# EAGLE design untitled_zaliv (EAGLE 5.07)
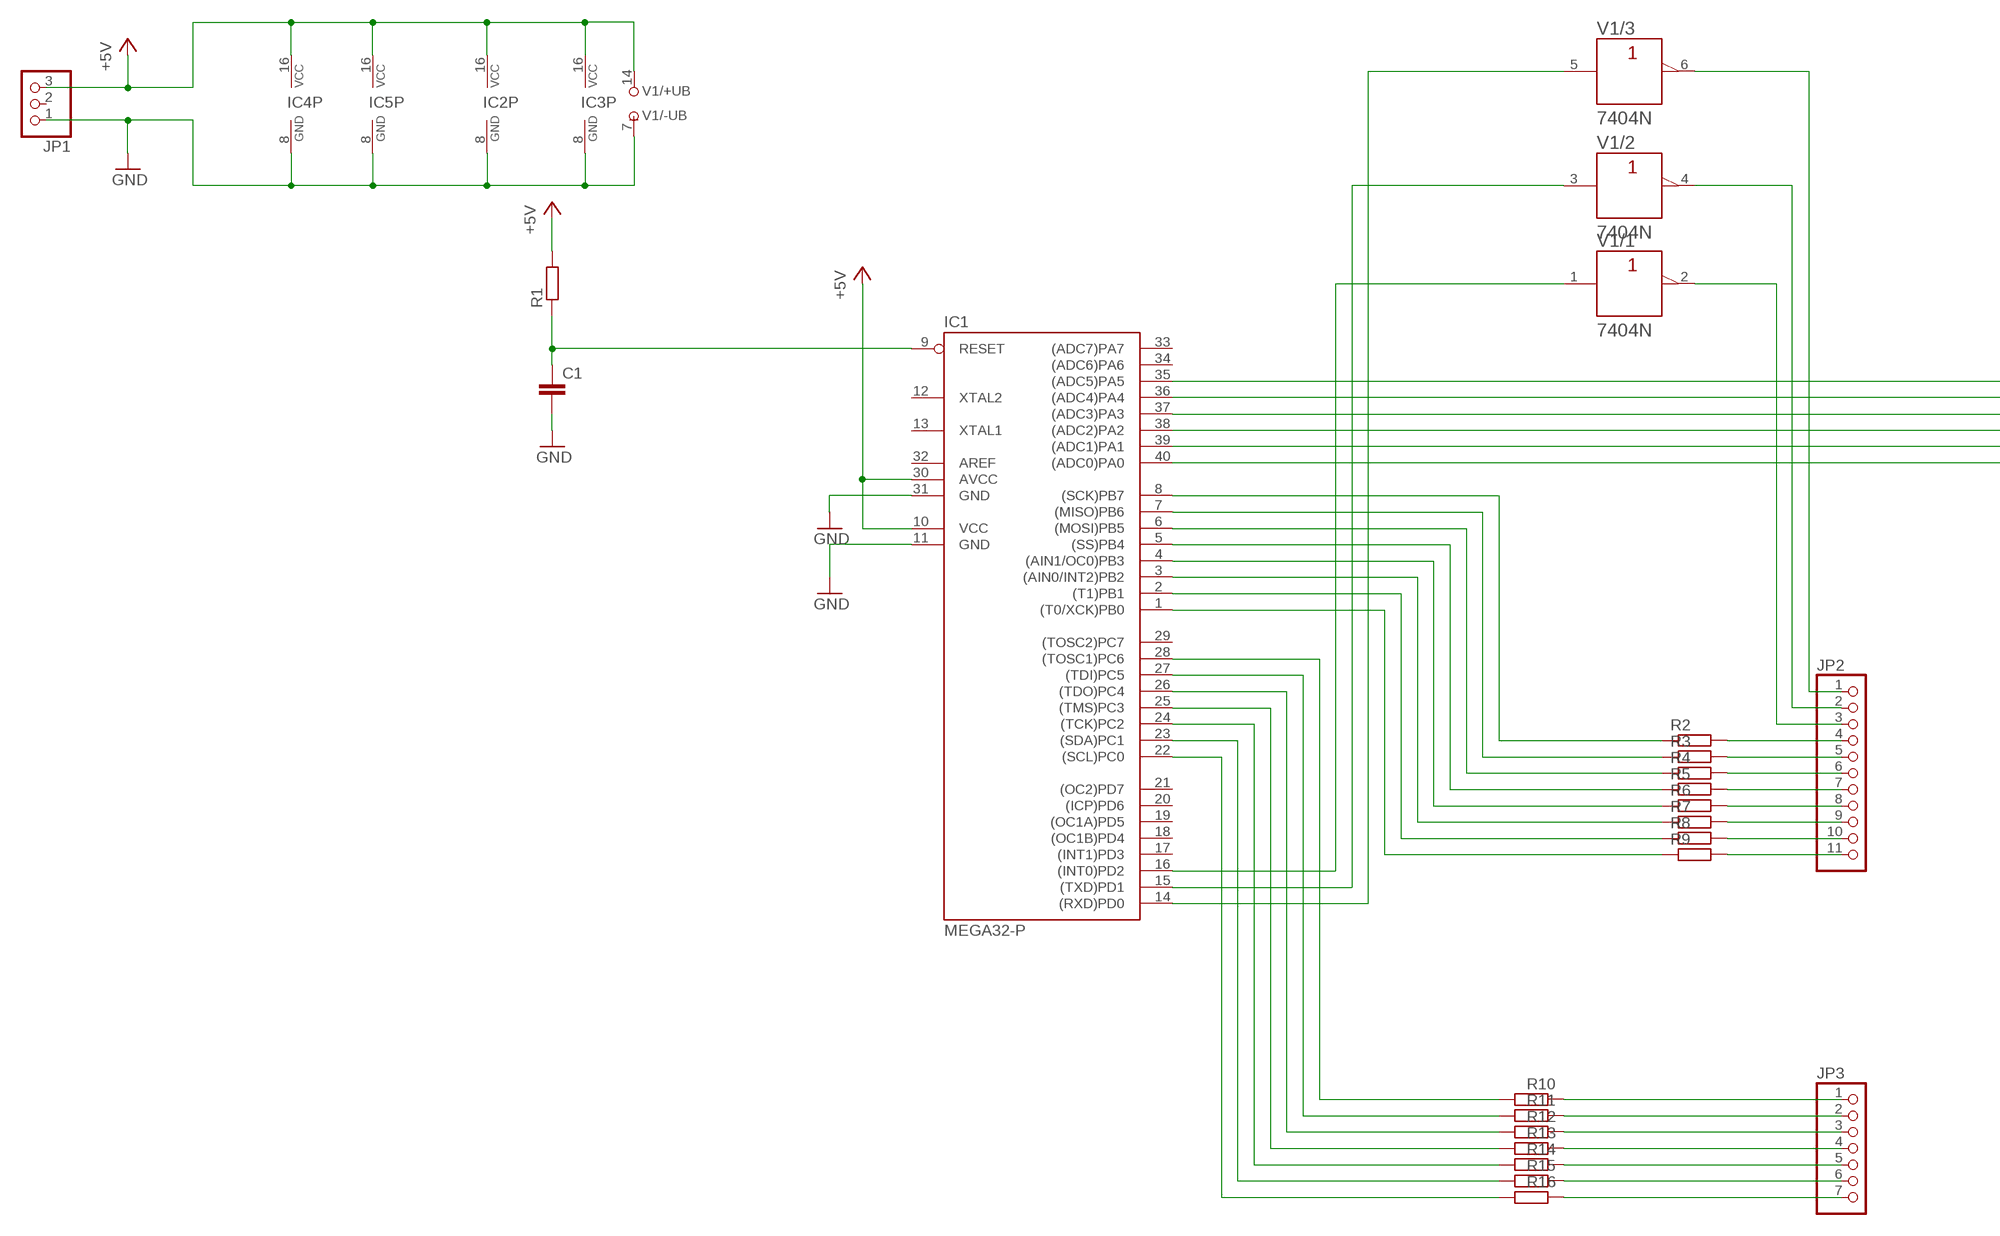
[diagram p0: schematic, sheet 1, part 1 of 2]
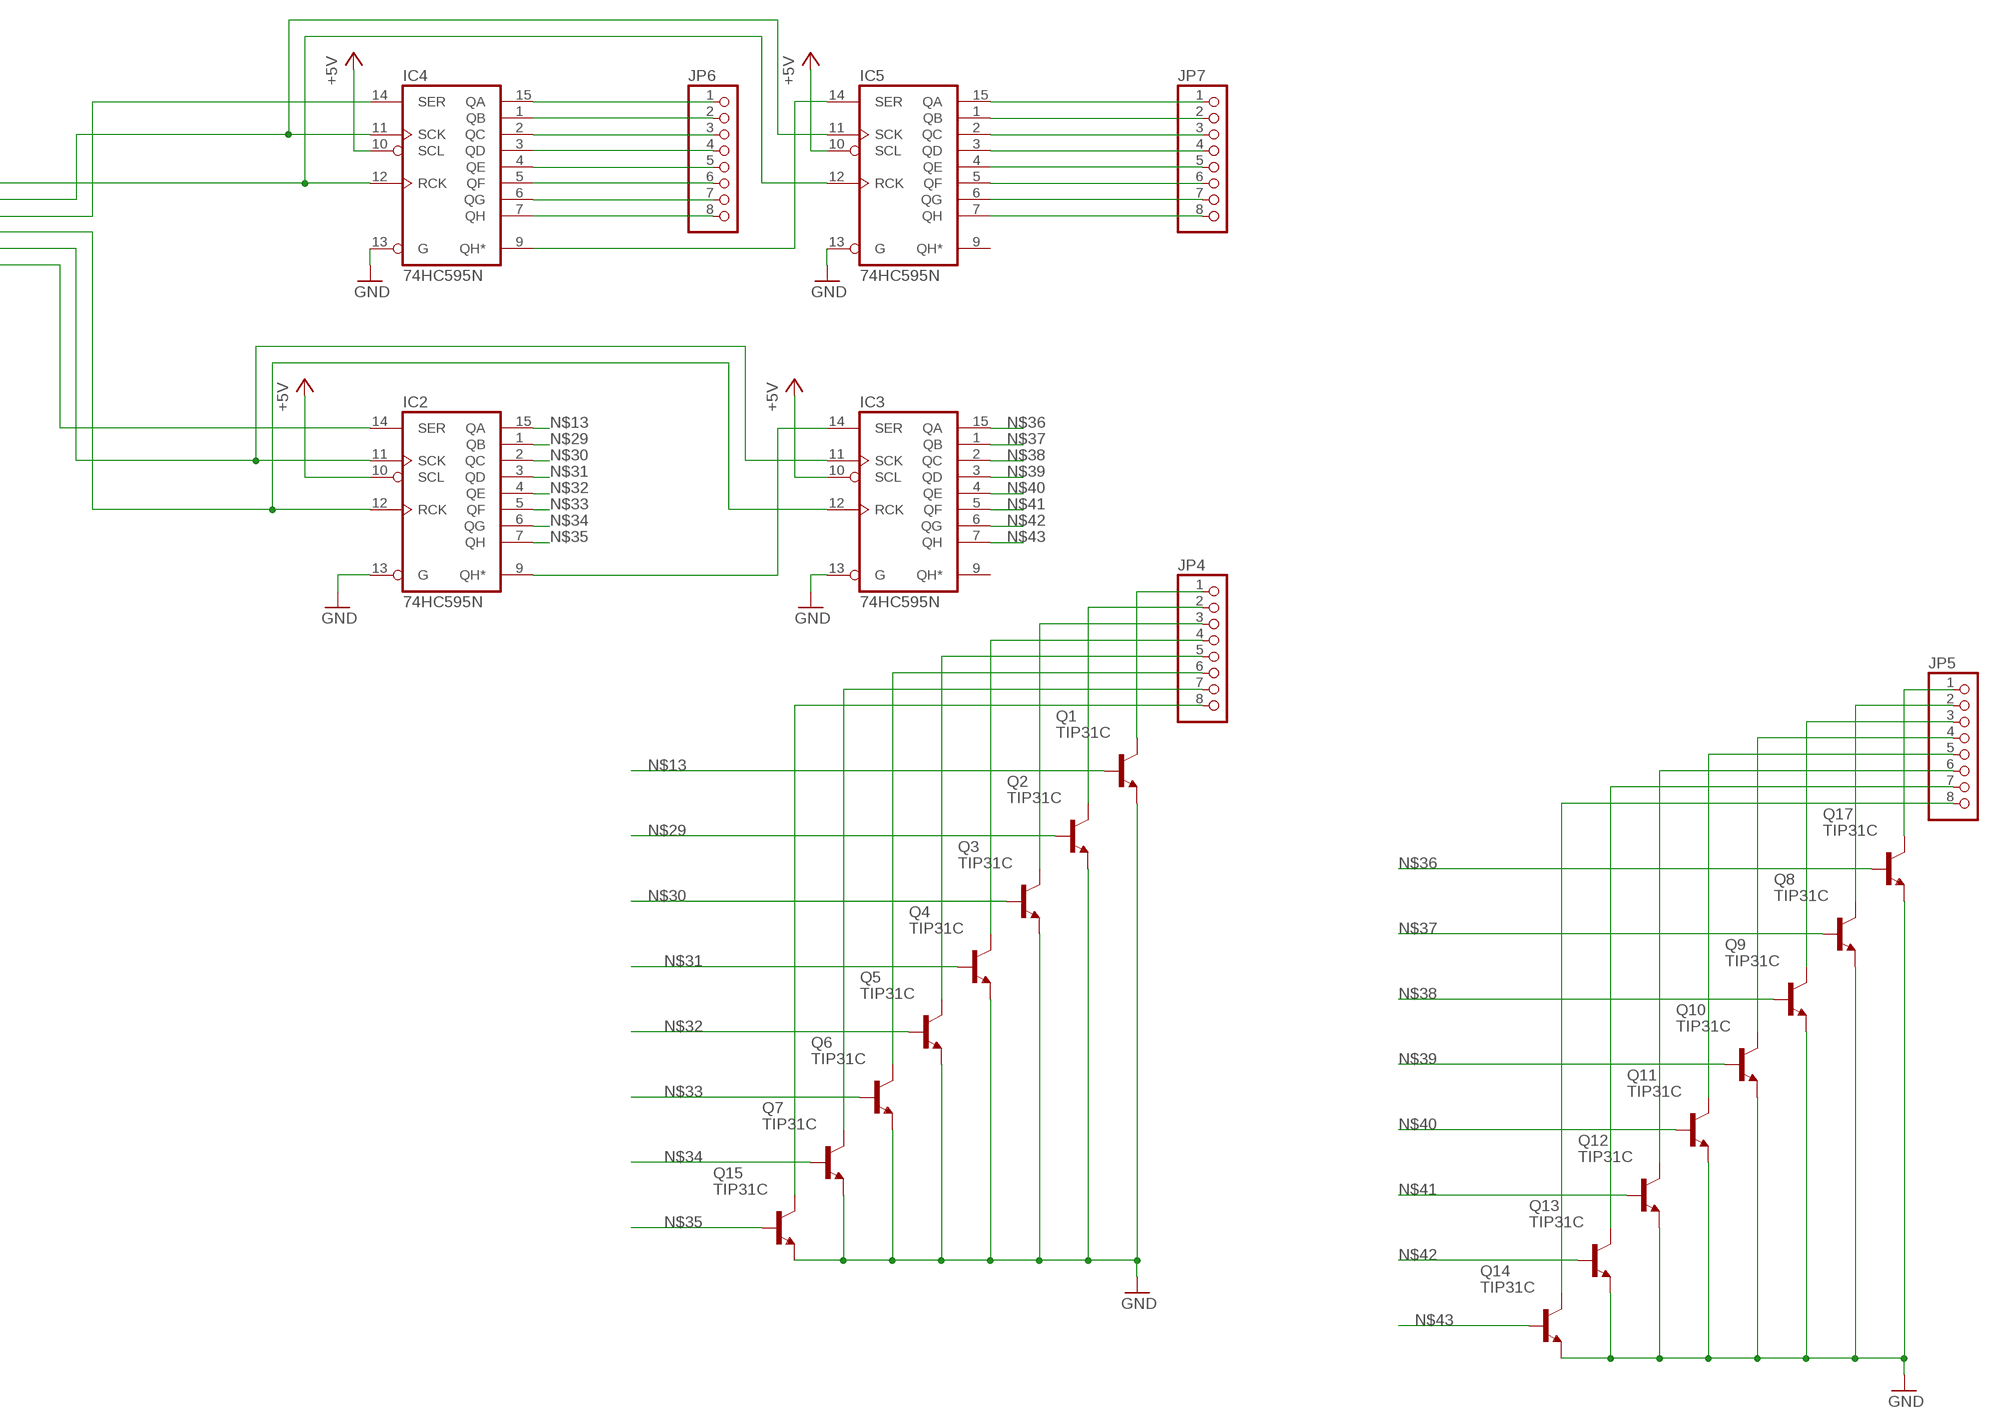
[diagram p1: schematic, sheet 1, part 2 of 2]

## Parts
C1  C-EU050-024X044  [C050-024X044]
IC1  MEGA32-P  [DIL40]
IC2  74HC595N  [DIL16]
IC3  74HC595N  [DIL16]
IC4  74HC595N  [DIL16]
IC5  74HC595N  [DIL16]
JP1  PINHD-1X3/90  [1X03/90]
JP2  PINHD-1X11/90  [1X11/90]
JP3  PINHD-1X7/90  [1X07/90]
JP4  PINHD-1X8/90  [1X08/90]
JP5  PINHD-1X8/90  [1X08/90]
JP6  PINHD-1X8/90  [1X08/90]
JP7  PINHD-1X8/90  [1X08/90]
Q1  TIP31C  [TO220]
Q2  TIP31C  [TO220]
Q3  TIP31C  [TO220]
Q4  TIP31C  [TO220]
Q5  TIP31C  [TO220]
Q6  TIP31C  [TO220]
Q7  TIP31C  [TO220]
Q8  TIP31C  [TO220]
Q9  TIP31C  [TO220]
Q10  TIP31C  [TO220]
Q11  TIP31C  [TO220]
Q12  TIP31C  [TO220]
Q13  TIP31C  [TO220]
Q14  TIP31C  [TO220]
Q15  TIP31C  [TO220]
Q17  TIP31C  [TO220]
R1  R-EU_0204/7  [0204/7]
R2  R-EU_0207/12  [0207/12]
R3  R-EU_0207/12  [0207/12]
R4  R-EU_0207/12  [0207/12]
R5  R-EU_0207/12  [0207/12]
R6  R-EU_0207/12  [0207/12]
R7  R-EU_0207/12  [0207/12]
R8  R-EU_0207/12  [0207/12]
R9  R-EU_0207/12  [0207/12]
R10  R-EU_0207/12  [0207/12]
R11  R-EU_0207/12  [0207/12]
R12  R-EU_0207/12  [0207/12]
R13  R-EU_0207/12  [0207/12]
R14  R-EU_0207/12  [0207/12]
R15  R-EU_0207/12  [0207/12]
R16  R-EU_0207/12  [0207/12]
V1  7404N  [DIL14]

## Nets
+5V: IC1.10(VCC) IC1.30(AVCC) IC2.10(SCL) IC2.16(VCC) IC3.10(SCL) IC3.16(VCC) IC4.10(SCL) IC4.16(VCC) IC5.10(SCL) IC5.16(VCC) JP1.3 R1.2 V1.14(/+UB:+UB)
GND: C1.2 IC1.11(GND) IC1.31(GND) IC2.8(GND) IC2.13(G) IC3.8(GND) IC3.13(G) IC4.8(GND) IC4.13(G) IC5.8(GND) IC5.13(G) JP1.1 Q1.3(E) Q2.3(E) Q3.3(E) Q4.3(E) Q5.3(E) Q6.3(E) Q7.3(E) Q8.3(E) Q9.3(E) Q10.3(E) Q11.3(E) Q12.3(E) Q13.3(E) Q14.3(E) Q15.3(E) Q17.3(E) V1.7(/-UB:-UB)
N$1: IC2.9(QH*) IC3.14(SER)
N$2: IC1.40((ADC0)PA0) IC2.14(SER)
N$3: IC1.39((ADC1)PA1) IC2.11(SCK) IC3.11(SCK)
N$4: IC1.38((ADC2)PA2) IC2.12(RCK) IC3.12(RCK)
N$5: IC1.37((ADC3)PA3) IC4.14(SER)
N$6: IC1.36((ADC4)PA4) IC4.11(SCK) IC5.11(SCK)
N$7: IC1.35((ADC5)PA5) IC4.12(RCK) IC5.12(RCK)
N$8: IC4.9(QH*) IC5.14(SER)
N$9: C1.1 IC1.9(RESET) R1.1
N$10: IC1.14((RXD)PD0) V1.5(/3:A)
N$11: IC1.15((TXD)PD1) V1.3(/2:A)
N$12: IC1.16((INT0)PD2) V1.1(/1:A)
N$13: IC2.15(QA) Q1.1(B)
N$14: IC1.8((SCK)PB7) R2.1
N$15: IC1.7((MISO)PB6) R3.1
N$16: IC1.6((MOSI)PB5) R4.1
N$17: IC1.5((SS)PB4) R5.1
N$18: IC1.4((AIN1/OC0)PB3) R6.1
N$19: IC1.3((AIN0/INT2)PB2) R7.1
N$20: IC1.2((T1)PB1) R8.1
N$21: IC1.1((T0/XCK)PB0) R9.1
N$22: IC1.22((SCL)PC0) R16.2
N$23: IC1.23((SDA)PC1) R15.2
N$24: IC1.24((TCK)PC2) R14.2
N$25: IC1.25((TMS)PC3) R13.2
N$26: IC1.26((TDO)PC4) R12.2
N$27: IC1.27((TDI)PC5) R11.2
N$28: IC1.28((TOSC1)PC6) R10.2
N$29: IC2.1(QB) Q2.1(B)
N$30: IC2.2(QC) Q3.1(B)
N$31: IC2.3(QD) Q4.1(B)
N$32: IC2.4(QE) Q5.1(B)
N$33: IC2.5(QF) Q6.1(B)
N$34: IC2.6(QG) Q7.1(B)
N$35: IC2.7(QH) Q15.1(B)
N$36: IC3.15(QA) Q17.1(B)
N$37: IC3.1(QB) Q8.1(B)
N$38: IC3.2(QC) Q9.1(B)
N$39: IC3.3(QD) Q10.1(B)
N$40: IC3.4(QE) Q11.1(B)
N$41: IC3.5(QF) Q12.1(B)
N$42: IC3.6(QG) Q13.1(B)
N$43: IC3.7(QH) Q14.1(B)
N$44: JP4.1 Q1.2(C)
N$45: JP4.2 Q2.2(C)
N$46: JP4.3 Q3.2(C)
N$47: JP4.4 Q4.2(C)
N$48: JP4.5 Q5.2(C)
N$49: JP4.6 Q6.2(C)
N$50: JP4.7 Q7.2(C)
N$51: JP4.8 Q15.2(C)
N$53: JP5.1 Q17.2(C)
N$54: JP5.2 Q8.2(C)
N$55: JP5.3 Q9.2(C)
N$56: JP5.4 Q10.2(C)
N$57: JP5.5 Q11.2(C)
N$58: JP5.6 Q12.2(C)
N$59: JP5.7 Q13.2(C)
N$60: IC4.15(QA) JP6.1
N$61: IC4.1(QB) JP6.2
N$62: IC4.2(QC) JP6.3
N$63: IC4.3(QD) JP6.4
N$64: IC4.4(QE) JP6.5
N$65: IC4.5(QF) JP6.6
N$66: IC4.6(QG) JP6.7
N$67: IC4.7(QH) JP6.8
N$68: IC5.15(QA) JP7.1
N$69: IC5.1(QB) JP7.2
N$70: IC5.2(QC) JP7.3
N$71: IC5.3(QD) JP7.4
N$72: IC5.4(QE) JP7.5
N$73: IC5.5(QF) JP7.6
N$74: IC5.6(QG) JP7.7
N$75: IC5.7(QH) JP7.8
N$76: JP2.4 R2.2
N$77: JP2.5 R3.2
N$78: JP2.6 R4.2
N$79: JP2.7 R5.2
N$80: JP2.8 R6.2
N$81: JP2.9 R7.2
N$82: JP2.10 R8.2
N$83: JP2.11 R9.2
N$84: JP5.8 Q14.2(C)
N$88: JP3.1 R10.1
N$89: JP3.2 R11.1
N$90: JP3.3 R12.1
N$91: JP3.4 R13.1
N$92: JP3.5 R14.1
N$93: JP3.6 R15.1
N$94: JP3.7 R16.1
N$95: JP2.1 V1.6(/3:Y)
N$101: JP2.2 V1.4(/2:Y)
N$102: JP2.3 V1.2(/1:Y)
Unconnected: IC1.12(XTAL2) IC1.13(XTAL1) IC1.17((INT1)PD3) IC1.18((OC1B)PD4) IC1.19((OC1A)PD5) IC1.20((ICP)PD6) IC1.21((OC2)PD7) IC1.29((TOSC2)PC7) IC1.32(AREF) IC1.33((ADC7)PA7) IC1.34((ADC6)PA6) IC3.9(QH*) IC5.9(QH*) JP1.2 V1.8(/4:Y) V1.9(/4:A) V1.10(/5:Y) V1.11(/5:A) V1.12(/6:Y) V1.13(/6:A)

## Library data of the parts
C1 = rcl:C-EU: CAPACITOR, European symbol
IC1 = atmel:MEGA32-P: MICROCONTROLLER 32 Kbytes FLASH 2 Kbytes SRAM 1 Kbytes EEPROM USART 8-channel 10 bit ADC Source: www.atmel.com .. doc2503.pdf
IC2-IC5 = 74xx-eu:74*595: 8-bit SHIFT REGISTER, output latch
JP1 = pinhead:PINHD-1X3: PIN HEADER
JP2 = pinhead:PINHD-1X11: PIN HEADER
JP3 = pinhead:PINHD-1X7: PIN HEADER
JP4-JP7 = pinhead:PINHD-1X8: PIN HEADER
Q1-Q15 Q17 = transistor-npn:TIP31C*: NPN Transistor
R1-R16 = rcl:R-EU_: RESISTOR, European symbol
V1 = 74ttl-din:74*04: Hex INVERTER

## Board
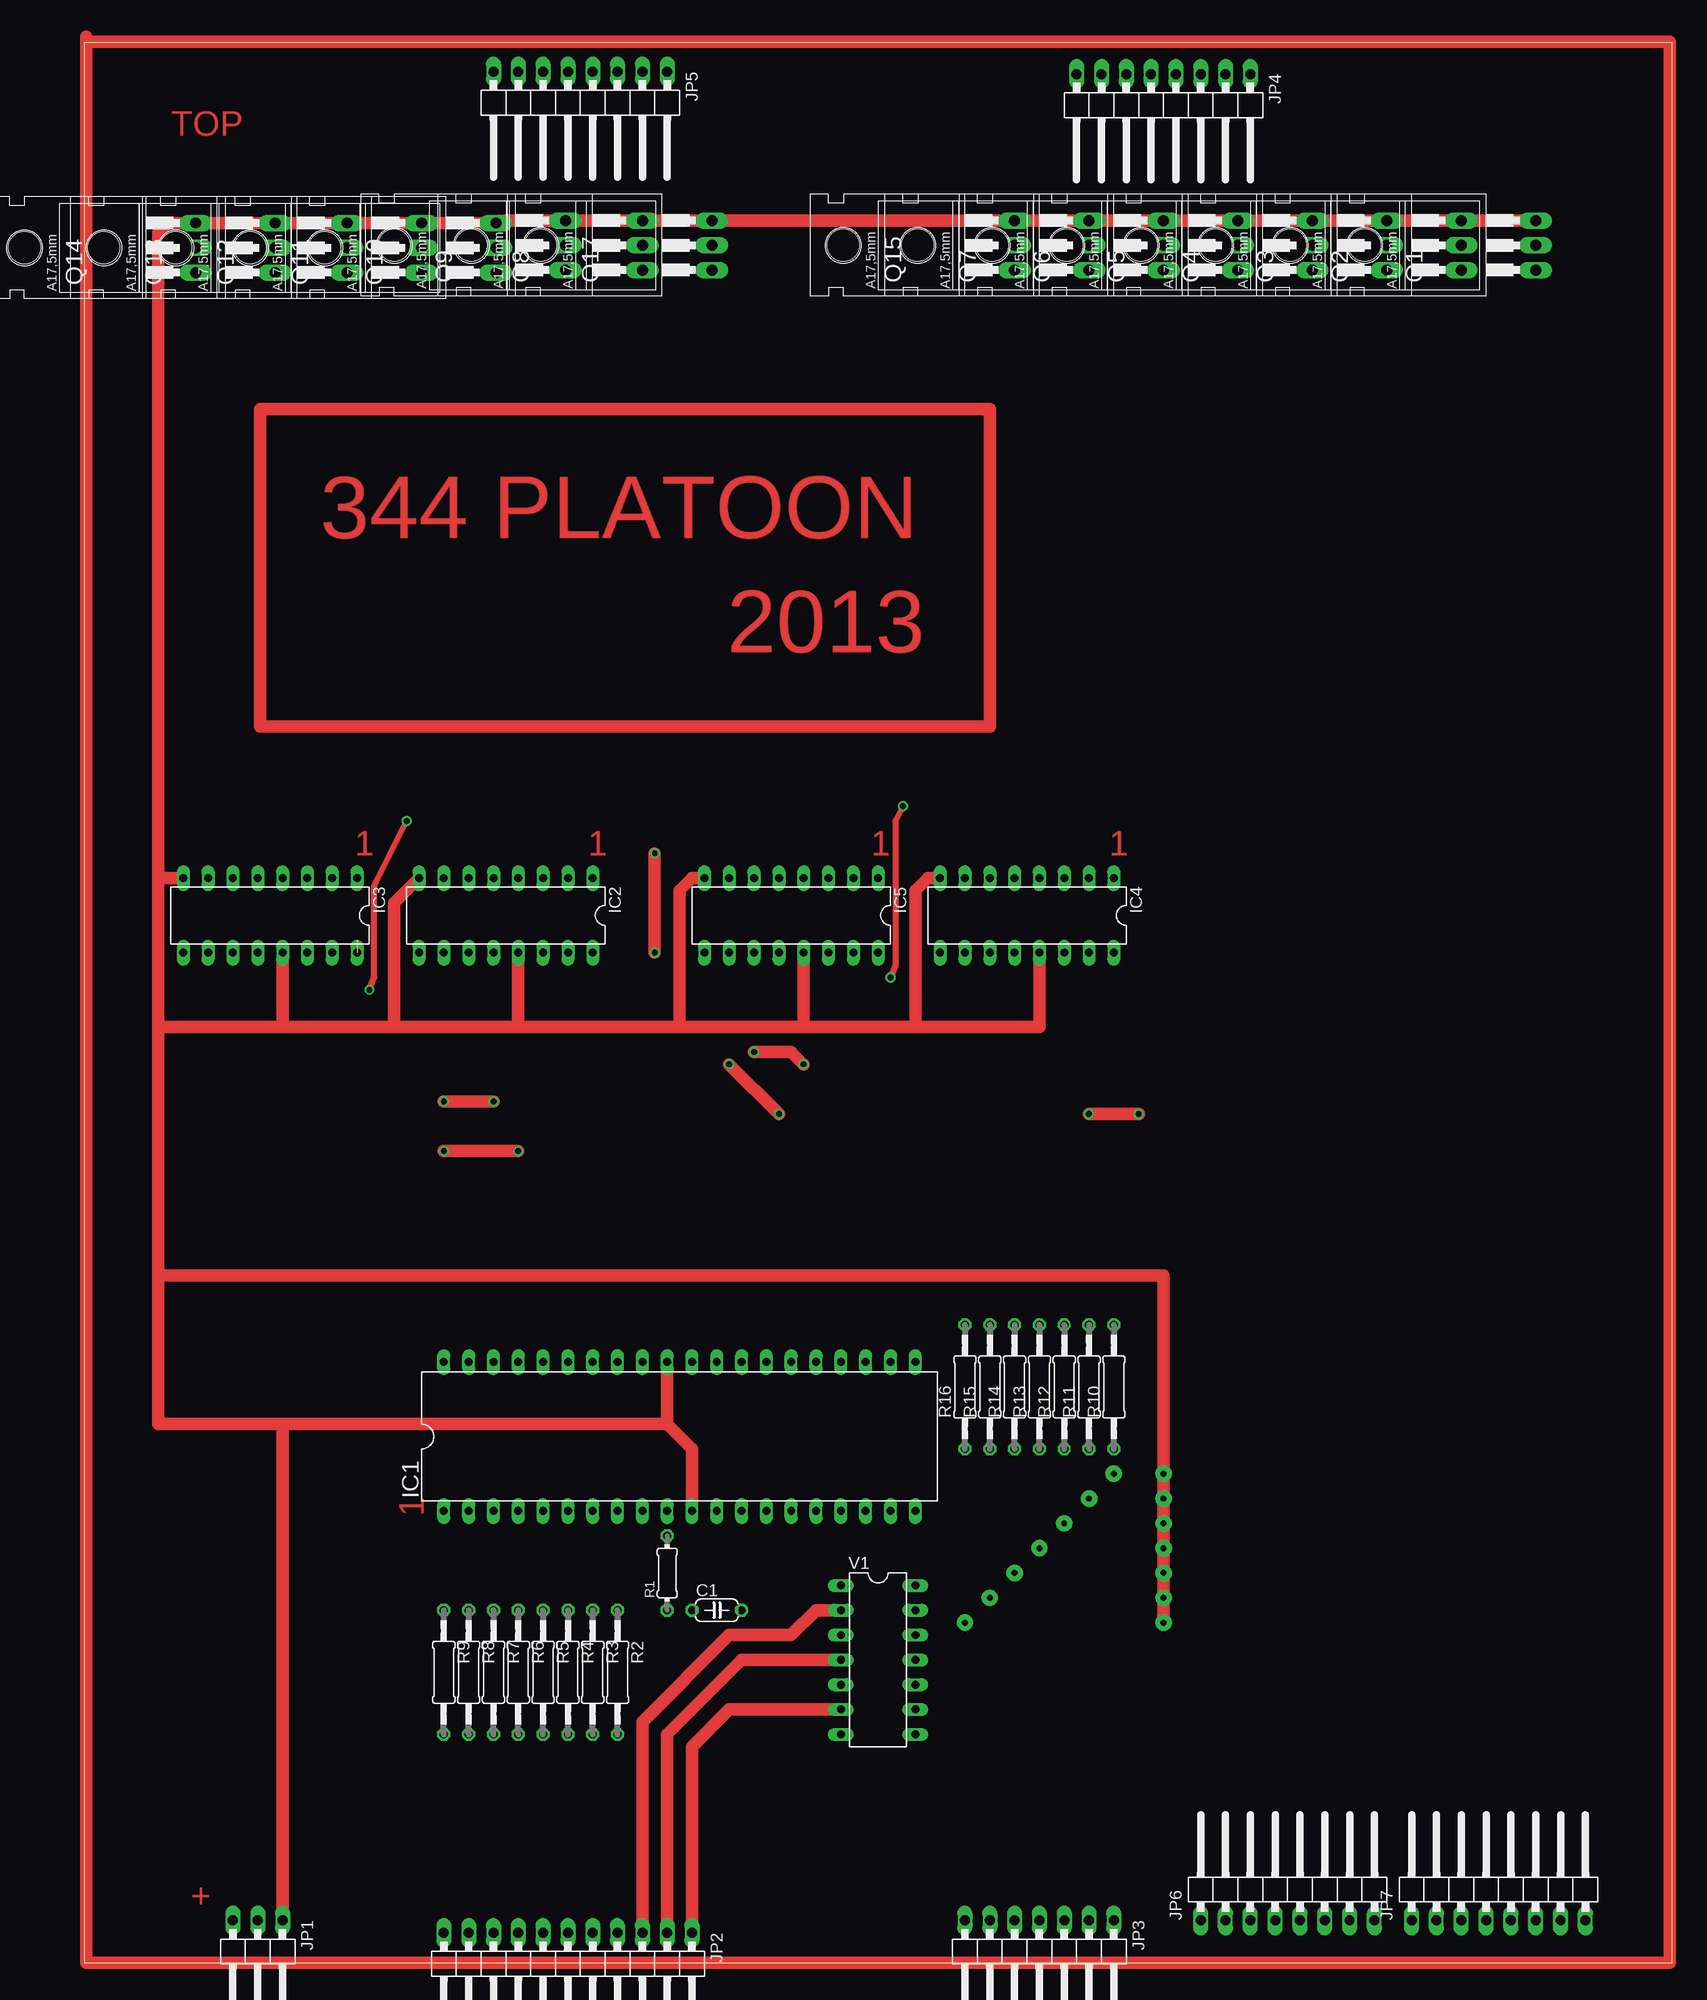
[diagram p2: board, top side]
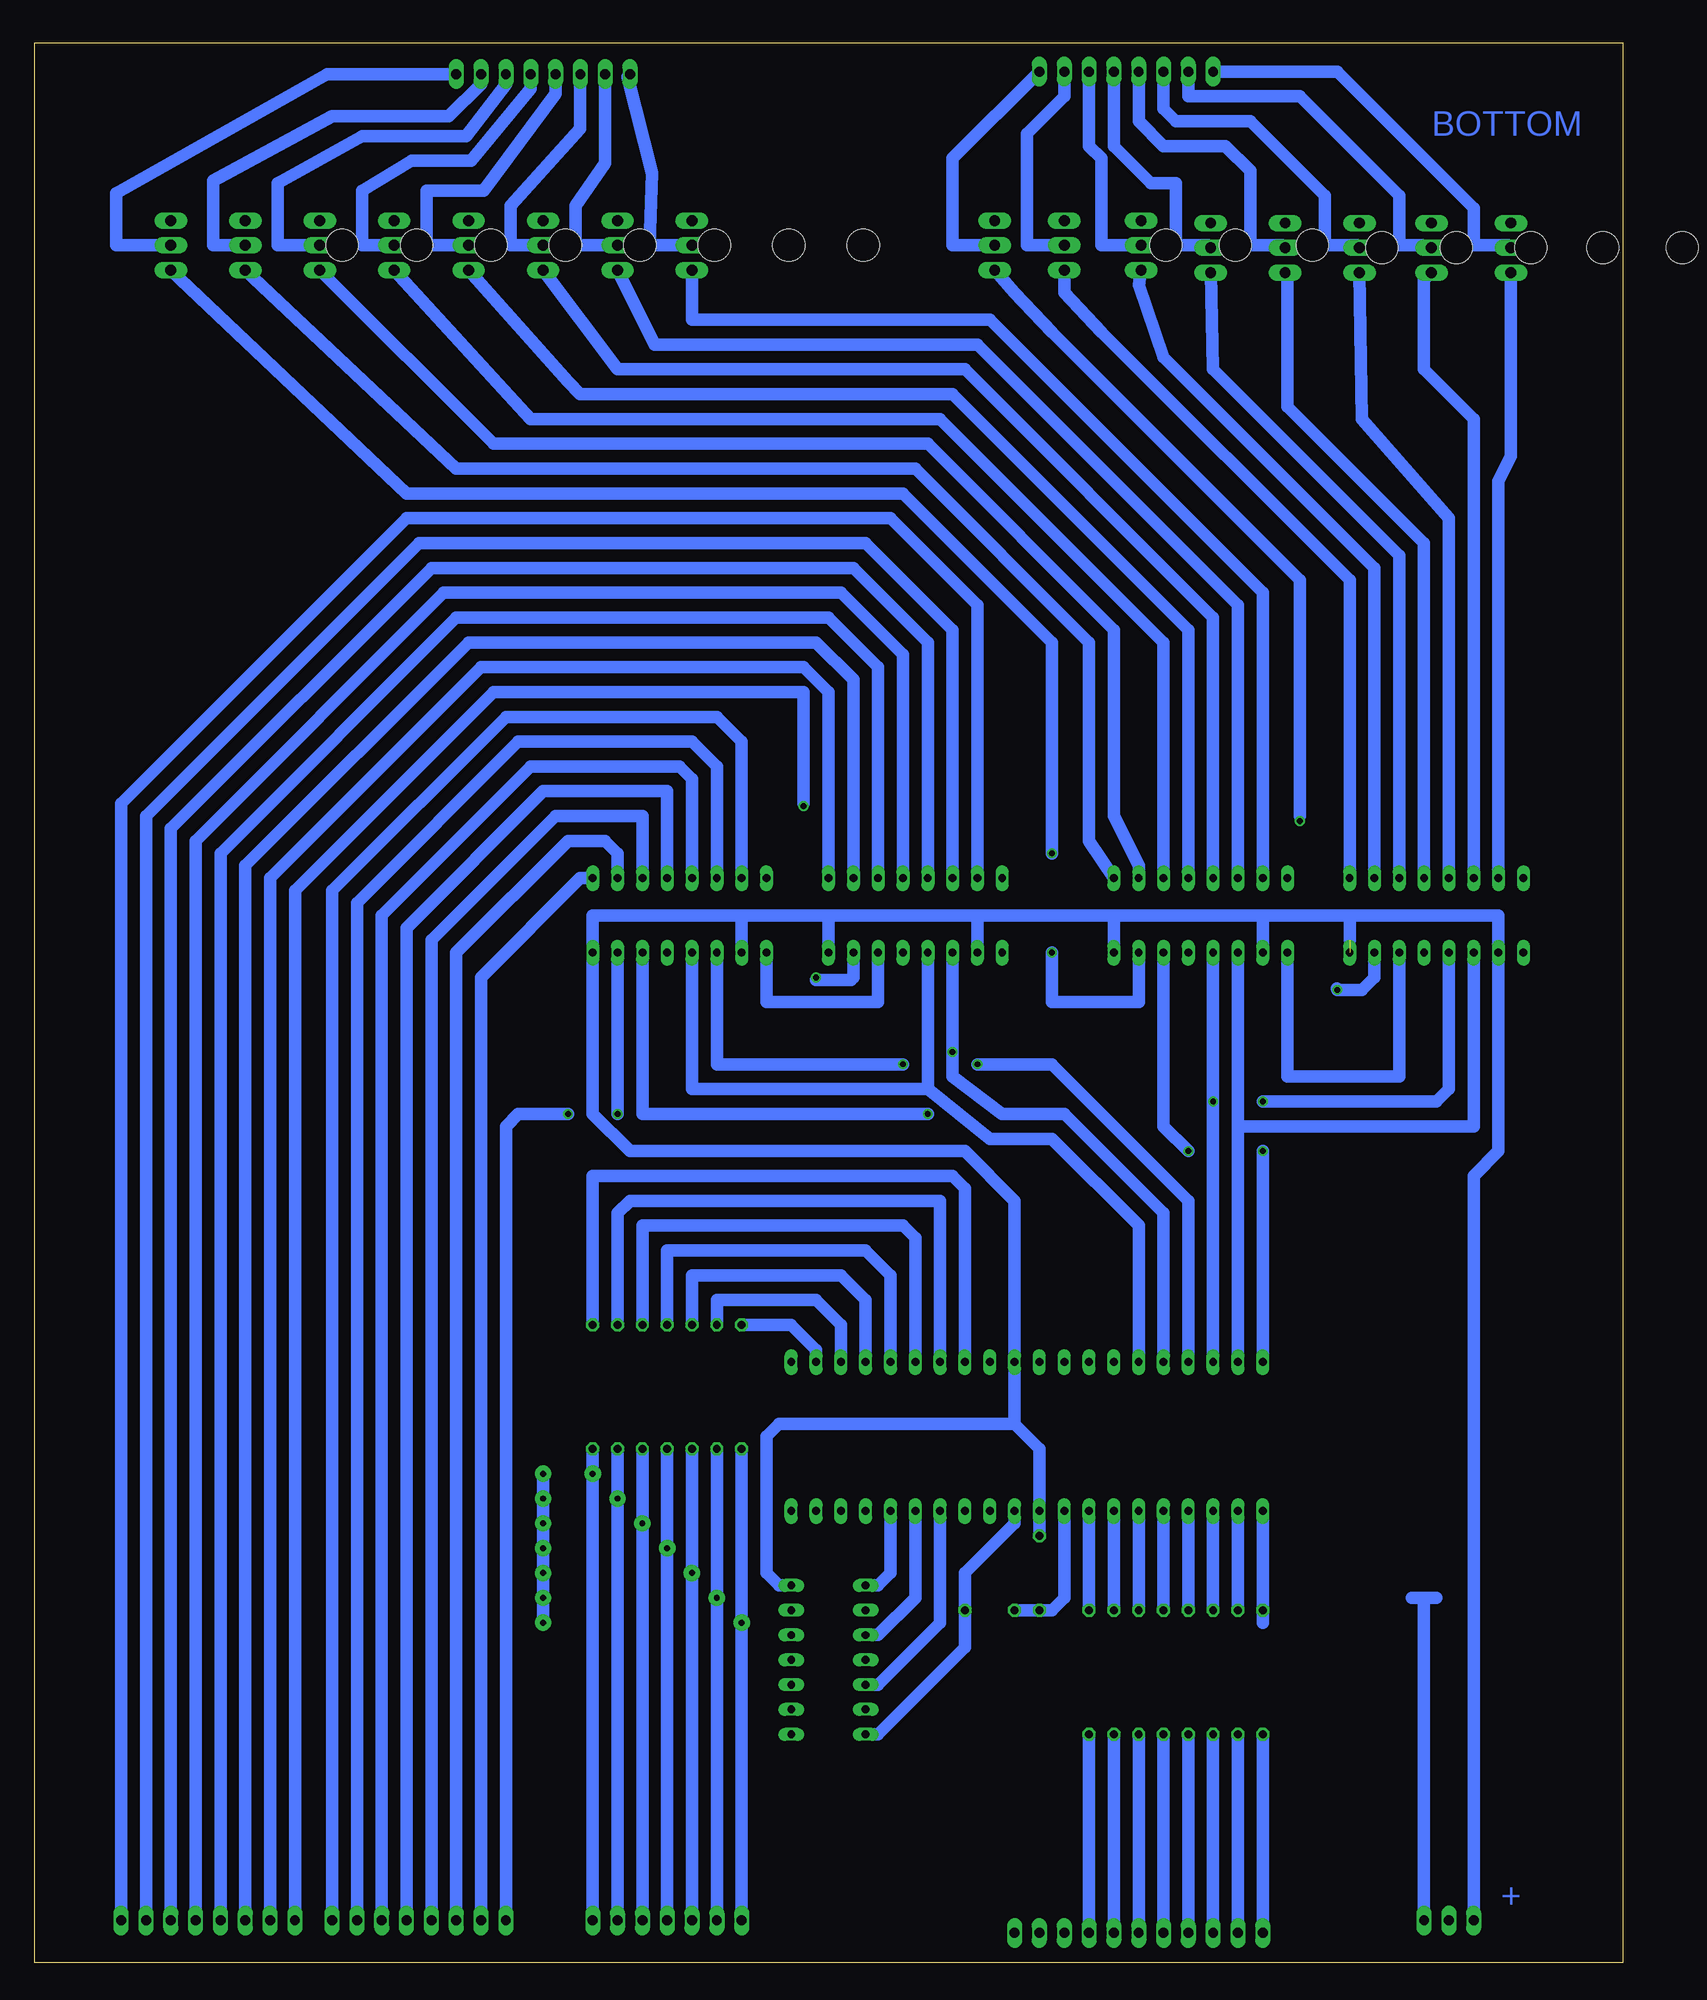
[diagram p3: board, bottom side, seen from below]

Size 162.54 x 196.52 mm. Coordinates in mm from the lower left corner, seen from the top.
Outline: 0,0 162.54,0 162.54,196.52 0,196.52 0,0
Copper layers (1*16): Top 0.035mm / dielectric 1.5mm / Bottom 0.035mm
Design rules "default *": minimum track width 10mil, minimum drill 24mil, track to track 8mil, track to pad 8mil, pad to pad 8mil, via to via 8mil, smd to smd 8mil, copper to edge 40mil, drill to drill 8mil, minimum pad ring 10mil, minimum via ring 8mil, stop-mask expansion 4mil, vias tented up to drill 0mil, thermal gap 10mil

### Footprints (pad centres in the part's own frame; a part is rotated, then mirrored left to right if it is on the bottom)
C050-024X044 = drill 0.813 octagon: 1 -2.54,0; 2 2.54,0
DIL40 = drill 0.813 long: 1 -24.13,-7.62; 2 -21.59,-7.62; 3 -19.05,-7.62; 4 -16.51,-7.62; 5 -13.97,-7.62; 6 -11.43,-7.62; 7 -8.89,-7.62; 8 -6.35,-7.62; 9 -3.81,-7.62; 10 -1.27,-7.62; 11 1.27,-7.62; 12 3.81,-7.62; 13 6.35,-7.62; 14 8.89,-7.62; 15 11.43,-7.62; 16 13.97,-7.62; 17 16.51,-7.62; 18 19.05,-7.62; 19 21.59,-7.62; 20 24.13,-7.62; 21 24.13,7.62; 22 21.59,7.62; 23 19.05,7.62; 24 16.51,7.62; 25 13.97,7.62; 26 11.43,7.62; 27 8.89,7.62; 28 6.35,7.62; 29 3.81,7.62; 30 1.27,7.62; 31 -1.27,7.62; 32 -3.81,7.62; 33 -6.35,7.62; 34 -8.89,7.62; 35 -11.43,7.62; 36 -13.97,7.62; 37 -16.51,7.62; 38 -19.05,7.62; 39 -21.59,7.62; 40 -24.13,7.62
DIL16 = drill 0.813 long: 1 -8.89,-3.81; 2 -6.35,-3.81; 3 -3.81,-3.81; 4 -1.27,-3.81; 5 1.27,-3.81; 6 3.81,-3.81; 7 6.35,-3.81; 8 8.89,-3.81; 9 8.89,3.81; 10 6.35,3.81; 11 3.81,3.81; 12 1.27,3.81; 13 -1.27,3.81; 14 -3.81,3.81; 15 -6.35,3.81; 16 -8.89,3.81
1X03/90 = drill 1.016 long: 1 -2.54,-3.81; 2 0,-3.81; 3 2.54,-3.81
1X11/90 = drill 1.016 long: 1 -12.7,-3.81; 2 -10.16,-3.81; 3 -7.62,-3.81; 4 -5.08,-3.81; 5 -2.54,-3.81; 6 0,-3.81; 7 2.54,-3.81; 8 5.08,-3.81; 9 7.62,-3.81; 10 10.16,-3.81; 11 12.7,-3.81
1X07/90 = drill 1.016 long: 1 -7.62,-3.81; 2 -5.08,-3.81; 3 -2.54,-3.81; 4 0,-3.81; 5 2.54,-3.81; 6 5.08,-3.81; 7 7.62,-3.81
1X08/90 = drill 1.016 long: 1 -8.89,-3.81; 2 -6.35,-3.81; 3 -3.81,-3.81; 4 -1.27,-3.81; 5 1.27,-3.81; 6 3.81,-3.81; 7 6.35,-3.81; 8 8.89,-3.81
TO220 = drill 1.118 long: 1 -2.54,-6.35; 2 0,-6.35; 3 2.54,-6.35 | hole 3.302: 0,11.176
0204/7 = drill 0.813 octagon: 1 -3.81,0; 2 3.81,0
0207/12 = drill 0.813 octagon: 1 -6.35,0; 2 6.35,0
DIL14 = drill 0.813 long: 1 -7.62,-3.81; 2 -5.08,-3.81; 3 -2.54,-3.81; 4 0,-3.81; 5 2.54,-3.81; 6 5.08,-3.81; 7 7.62,-3.81; 8 7.62,3.81; 9 5.08,3.81; 10 2.54,3.81; 11 0,3.81; 12 -2.54,3.81; 13 -5.08,3.81; 14 -7.62,3.81

### Placement (x,y rotation side)
C1  64.77,36.07 0 top
IC1  60.96,53.85 0 top
IC2  43.18,107.19 180 top
IC3  19.05,107.19 180 top
IC4  96.52,107.19 180 top
IC5  72.39,107.19 180 top
JP1  17.78,0.51 180 top
JP2  49.53,-0.76 180 top
JP3  97.79,0.51 180 top
JP4  110.49,189.48 180 top
JP5  50.8,189.74 180 top
JP6  123.19,8.13 0 top
JP7  144.78,8.13 0 top
Q1  142.24,175.77 90 top
Q2  134.62,175.77 90 top
Q3  127,175.77 90 top
Q4  119.38,175.77 90 top
Q5  111.76,175.77 90 top
Q6  104.14,175.77 90 top
Q7  96.52,175.77 90 top
Q8  50.8,175.77 90 top
Q9  42.93,175.77 90 top
Q10  35.81,175.51 90 top
Q11  28.19,175.51 90 top
Q12  20.57,175.51 90 top
Q13  13.21,175.51 90 top
Q14  5.08,175.51 90 top
Q15  88.9,175.77 90 top
Q17  57.91,175.77 90 top
R1  59.69,39.88 90 top
R2  54.61,29.72 270 top
R3  52.07,29.72 270 top
R4  49.53,29.72 270 top
R5  46.99,29.72 270 top
R6  44.45,29.72 270 top
R7  41.91,29.72 270 top
R8  39.37,29.72 270 top
R9  36.83,29.72 270 top
R10  105.41,58.93 90 top
R11  102.87,58.93 90 top
R12  100.33,58.93 90 top
R13  97.79,58.93 90 top
R14  95.25,58.93 90 top
R15  92.71,58.93 90 top
R16  90.17,58.93 90 top
V1  81.28,30.99 270 top

### Tracks (layer width: path | path; a pad name or v marks a point on that pad's centre or on a via)
+5V  (1 unrouted)
  Bottom 1.27: R1.2 IC1.10 59.69,52.58 62.23,55.12 | 62.23,55.12 IC1.30 62.23,77.98 67.31,83.06 101.6,83.06 105.41,86.87 IC4.16 105.41,107.19 90.17,107.19 | JP1.3 15.24,80.52 12.7,83.06 IC3.10 12.7,107.19 27.94,107.19 | 36.83,107.19 IC2.10 | 27.94,107.19 36.83,107.19 | 27.94,107.19 27.94,104.65 | 36.83,107.19 52.07,107.19 | 52.07,107.19 IC2.16 | 52.07,107.19 66.04,107.19 | 90.17,107.19 IC4.10 | 81.28,107.19 IC5.16 | 81.28,107.19 90.17,107.19 | 66.04,107.19 IC5.10 | 66.04,107.19 81.28,107.19 | V1.14 86.36,38.61 87.63,39.88 87.63,53.85 86.36,55.12 62.23,55.12
GND  (via drill 0.6 pad 1.68)
  Top 1.27: 59.69,55.12 IC1.31 | 59.69,55.12 62.23,52.58 IC1.11 | Q1.3 Q2.3 Q3.3 Q4.3 Q5.3 Q6.3 Q7.3 Q15.3 Q17.3 Q8.3 Q9.3 42.42,178.31 Q10.3 Q11.3 Q12.3 Q13.3 Q14.3 8.64,178.05 7.62,177.04 7.62,111 | 7.62,111 IC3.8 | 7.62,111 7.62,95.76 | 7.62,95.76 7.62,70.36 | 7.62,70.36 7.62,55.12 20.32,55.12 | 20.32,55.12 59.69,55.12 | 20.32,55.12 JP1.1 | IC4.8 86.36,111 85.09,109.73 85.09,95.76 | 85.09,95.76 97.79,95.76 IC4.13 | 73.66,95.76 85.09,95.76 | 73.66,95.76 IC5.13 | IC5.8 62.23,111 60.96,109.73 60.96,95.76 | 60.96,95.76 73.66,95.76 | 44.45,95.76 60.96,95.76 | 44.45,95.76 IC2.13 | IC2.8 31.75,108.46 31.75,95.76 | 31.75,95.76 44.45,95.76 | 20.32,95.76 31.75,95.76 | 20.32,95.76 IC3.13 | 7.62,95.76 20.32,95.76 | v110.49,34.8 v110.49,50.04 110.49,70.36 7.62,70.36
  Bottom 1.27: IC1.11 62.23,44.96 67.31,39.88 C1.2 67.31,32.26 76.2,23.37 V1.7 | JP1.1 20.32,37.34 | v110.49,50.04 v110.49,34.8
N$1
  Bottom 1.27: IC3.14 22.86,90.68 34.29,90.68 IC2.9
N$2  (via drill 0.6)
  Top 1.27: v36.83,83.06 v44.45,83.06
  Bottom 1.27: IC2.14 46.99,85.6 v44.45,83.06 | IC1.40 v36.83,83.06
N$3
  Bottom 1.27: IC1.39 39.37,85.6 | 39.37,85.6 IC2.11 | IC3.11 15.24,85.6 39.37,85.6
N$4  (via drill 0.6)
  Top 1.27: v41.91,88.14 v36.83,88.14
  Bottom 1.27: IC1.38 v41.91,88.14 IC2.12 | IC3.12 17.78,89.41 19.05,88.14 v36.83,88.14
N$5  (via drill 0.6)
  Top 1.27: v66.04,91.95 v71.12,86.87
  Bottom 1.27: IC1.37 44.45,77.98 58.42,91.95 v66.04,91.95 | IC4.14 100.33,86.87 v71.12,86.87
N$6  (via drill 0.6)
  Top 1.27: v73.66,91.95 72.39,93.22 v68.58,93.22
  Bottom 1.27: IC1.36 46.99,76.71 57.15,86.87 63.5,86.87 68.58,90.68 v68.58,93.22 IC5.11 | IC4.11 92.71,91.95 v73.66,91.95
N$7
  Bottom 1.27: IC1.35 49.53,75.44 58.42,84.33 64.77,84.33 71.12,89.41 | 71.12,89.41 IC5.12 | IC4.12 95.25,89.41 71.12,89.41
N$8
  Bottom 1.27: IC5.14 76.2,98.3 87.63,98.3 IC4.9
N$9
  Bottom 1.27: C1.1 R1.1 58.42,36.07 57.15,37.34 IC1.9
N$10
  Bottom 1.27: IC1.14 69.85,34.8 76.2,28.45 V1.5
N$11
  Bottom 1.27: IC1.15 72.39,37.34 76.2,33.53 V1.3
N$12
  Bottom 1.27: IC1.16 74.93,39.88 76.2,38.61 V1.1
N$13  (via drill 0.6)
  Top 1.27: v58.42,113.54 v58.42,103.38
  Bottom 1.27: IC2.15 49.53,98.3 58.42,98.3 v58.42,103.38 | v58.42,113.54 58.42,135.13 73.66,150.37 124.46,150.37 Q1.1
N$14
  Bottom 1.27: R2.1 IC1.8
N$15
  Bottom 1.27: R3.1 IC1.7
N$16
  Bottom 1.27: R4.1 IC1.6
N$17
  Bottom 1.27: R5.1 IC1.5
N$18
  Bottom 1.27: R6.1 IC1.4
N$19
  Bottom 1.27: R7.1 IC1.3
N$20
  Bottom 1.27: R8.1 IC1.2
N$21
  Bottom 1.27: IC1.1 R9.1 36.83,34.8
N$22
  Bottom 1.27: IC1.22 82.55,62.74 85.09,65.28 R16.2
N$23
  Bottom 1.27: IC1.23 80.01,65.28 82.55,67.82 92.71,67.82 R15.2
N$24
  Bottom 1.27: IC1.24 77.47,67.82 80.01,70.36 95.25,70.36 R14.2
N$25
  Bottom 1.27: IC1.25 74.93,70.36 77.47,72.9 97.79,72.9 R13.2
N$26
  Bottom 1.27: IC1.26 72.39,74.17 73.66,75.44 100.33,75.44 R12.2
N$27
  Bottom 1.27: IC1.27 69.85,77.98 101.6,77.98 102.87,76.71 R11.2
N$28
  Bottom 1.27: IC1.28 67.31,79.25 68.58,80.52 105.41,80.52 R10.2
N$29
  Bottom 1.27: IC2.1 54.61,114.81 54.61,135.13 72.39,152.91 119.38,152.91 Q2.1
N$30
  Bottom 1.27: IC2.2 49.53,112.27 52.07,117.35 52.07,136.4 71.12,155.45 115.57,155.45 Q3.1
N$31
  Bottom 1.27: IC2.3 46.99,135.13 69.85,157.99 111.76,157.99 Q4.1
N$32
  Bottom 1.27: IC2.4 44.45,136.4 68.58,160.53 106.68,160.53 107.95,161.8 Q5.1
N$33
  Bottom 1.27: IC2.5 41.91,137.67 67.31,163.07 102.87,163.07 Q6.1
N$34
  Bottom 1.27: IC2.6 39.37,138.94 66.04,165.61 99.06,165.61 Q7.1
N$35
  Bottom 1.27: IC2.7 36.83,140.21 64.77,168.15 95.25,168.15 Q15.1
N$36  (via drill 0.6)
  Top 0.61: v33.02,116.84 29.72,110.24 29.72,100.84 v29.21,99.57
  Bottom 0.61: v33.02,116.84 33.02,117.35
  Bottom 1.27: IC3.15 25.4,100.84 26.67,99.57 28.96,99.57 29.24,99.7 v29.21,99.57 | Q17.1 62.23,170.94 58.42,166.88 33.02,141.48 33.02,117.35
N$37
  Bottom 1.27: IC3.1 27.94,141.48 53.34,166.88 57.15,170.94 Q8.1
N$38
  Bottom 1.27: IC3.2 25.4,142.75 46.99,164.34 49.53,171.7 Q9.1
N$39
  Bottom 1.27: Q10.1 41.91,163.07 22.86,144.02 IC3.3
N$40
  Bottom 1.27: IC3.4 20.32,145.29 34.29,159.26 34.29,172.72 Q11.1
N$41
  Bottom 1.27: Q12.1 26.67,157.99 17.78,147.83 IC3.5
N$42
  Bottom 1.27: IC3.6 15.24,157.99 20.32,163.07 20.32,172.21 Q13.1
N$43
  Bottom 1.27: Q14.1 11.43,154.18 12.7,151.64 IC3.7
N$44
  Bottom 1.27: JP4.1 132.59,193.29 154.18,181.1 154.18,175.77 Q1.2
N$45
  Bottom 1.27: JP4.2 116.84,192.28 120.14,188.98 132.08,188.98 144.27,182.37 144.27,175.77 Q2.2
N$46
  Bottom 1.27: JP4.3 114.3,192.28 118.36,186.94 129.03,186.94 137.67,182.12 137.67,175.77 Q3.2
N$47
  Bottom 1.27: JP4.4 111.76,191.77 117.86,184.4 123.95,184.4 129.03,181.36 129.03,175.77 Q4.2
N$48
  Bottom 1.27: JP4.5 109.22,191.26 116.59,181.36 122.43,181.36 122.43,175.77 Q5.2
N$49
  Bottom 1.27: JP4.6 106.68,187.71 113.79,179.83 113.79,175.77 Q6.2
N$50
  Bottom 1.27: JP4.7 104.14,184.15 107.19,179.83 107.19,175.77 Q7.2
N$51
  Bottom 1.27: Q15.2 99.57,175.77 99.31,183.13 101.85,193.04 JP4.8
N$52
  Bottom 1.27: 78.99,100.58 82.55,100.58
N$53
  Bottom 1.27: Q17.2 68.58,175.77 68.58,184.66 JP5.1
N$54
  Bottom 1.27: JP5.2 57.15,191.01 60.96,187.2 60.96,175.77 Q8.2
N$55
  Bottom 1.27: JP5.3 54.61,185.93 53.34,184.66 53.34,175.77 Q9.2
N$56
  Bottom 1.27: JP5.4 52.07,185.93 48.26,182.12 45.72,182.12 45.72,175.77 42.42,175.77 Q10.2
N$57
  Bottom 1.27: JP5.5 49.53,188.47 46.99,185.93 40.64,185.93 38.1,183.39 38.1,175.77 34.8,175.77 Q11.2
N$58
  Bottom 1.27: JP5.6 46.99,189.74 45.72,188.47 38.1,188.47 30.48,180.85 30.48,175.77 27.18,175.77 Q12.2
N$59
  Bottom 1.27: JP5.7 44.45,191.01 33.02,191.01 22.86,180.85 22.86,175.77 20.57,175.77 Q13.2
N$60  (via drill 0.6)
  Top 1.27: v107.95,86.87 v102.87,86.87
  Bottom 1.27: v107.95,86.87 113.03,86.87 114.3,85.6 JP6.1 | v102.87,86.87 IC4.15
N$61
  Bottom 1.27: IC4.1 106.68,111 116.84,100.84 JP6.2
N$62
  Bottom 1.27: IC4.2 102.87,113.54 104.14,114.81 107.95,114.81 119.38,103.38 JP6.3
N$63
  Bottom 1.27: JP6.4 121.92,104.65 109.22,117.35 100.33,117.35 IC4.3
N$64
  Bottom 1.27: IC4.4 97.79,119.89 110.49,119.89 124.46,105.92 JP6.5
N$65
  Bottom 1.27: JP6.6 127,107.19 111.76,122.43 96.52,122.43 95.25,121.16 IC4.5
N$66
  Bottom 1.27: IC4.6 92.71,122.43 95.25,124.97 113.03,124.97 129.54,108.46 JP6.7
N$67
  Bottom 1.27: JP6.8 132.08,109.73 114.3,127.51 92.71,127.51 90.17,124.97 IC4.7
N$68  (via drill 0.6)
  Top 0.61: v82.55,100.84 83.06,102.11 83.06,116.84 v83.82,118.36
  Bottom 0.61: v82.55,100.84 78.74,100.84 | 83.82,118.62 v83.82,118.36
  Bottom 1.27: 78.74,100.84 IC5.15 | JP7.1 135.89,109.73 115.57,130.05 83.82,130.05 83.82,118.62
N$69
  Bottom 1.27: JP7.2 138.43,111 116.84,132.59 83.82,132.59 81.28,130.05 IC5.1
N$70
  Bottom 1.27: IC5.2 78.74,131.32 82.55,135.13 118.11,135.13 140.97,112.27 JP7.3
N$71
  Bottom 1.27: JP7.4 143.51,113.54 119.38,137.67 81.28,137.67 76.2,132.59 IC5.3
N$72
  Bottom 1.27: IC5.4 73.66,133.86 80.01,140.21 120.65,140.21 146.05,114.81 JP7.5
N$73
  Bottom 1.27: JP7.6 148.59,116.08 121.92,142.75 78.74,142.75 71.12,135.13 IC5.5
N$74
  Bottom 1.27: IC5.6 68.58,136.4 77.47,145.29 123.19,145.29 151.13,117.35 JP7.7
N$75
  Bottom 1.27: JP7.8 153.67,118.62 124.46,147.83 74.93,147.83 66.04,138.94 IC5.7
N$76
  Bottom 1.27: JP2.4 R2.2
N$77
  Bottom 1.27: R3.2 JP2.5
N$78
  Bottom 1.27: JP2.6 R4.2
N$79
  Bottom 1.27: R5.2 JP2.7
N$80
  Bottom 1.27: JP2.8 R6.2
N$81
  Bottom 1.27: R7.2 JP2.9
N$82
  Bottom 1.27: JP2.10 R8.2
N$83
  Bottom 1.27: R9.2 JP2.11
N$84
  Bottom 1.27: JP5.8 29.21,193.55 15.24,179.58 15.24,175.77 11.68,175.77 Q14.2
N$85
  Top 1.27: 1.02,196.6 162.31,196.6 162.31,0 0.25,0 0.25,197.1
N$86
  Top 1.27: 18.03,159 92.71,159 92.71,126.49 18.03,126.49 18.03,159
N$87
  Bottom 1.27: 19.05,37.34 21.59,37.34
N$88  (via drill 0.6 pad 1.68)
  Bottom 1.27: JP3.1 v105.41,50.04 R10.1
N$89  (via drill 0.6 pad 1.68)
  Bottom 1.27: JP3.2 v102.87,47.5 R11.1
N$90  (via drill 0.6 pad 1.68)
  Bottom 1.27: JP3.3 v100.33,44.96 R12.1
N$91  (via drill 0.6 pad 1.68)
  Bottom 1.27: JP3.4 v97.79,42.42 R13.1
N$92  (via drill 0.6 pad 1.68)
  Bottom 1.27: JP3.5 v95.25,39.88 R14.1
N$93  (via drill 0.6 pad 1.68)
  Bottom 1.27: JP3.6 v92.71,37.34 R15.1
N$94  (via drill 0.6 pad 1.68)
  Bottom 1.27: v90.17,34.8 JP3.7 R16.1
N$95
  Top 1.27: JP2.1 62.23,22.1 66.04,25.91 V1.6
N$96  (via drill 0.6 pad 1.68)
  other vias: 110.49,47.5
N$97  (via drill 0.6 pad 1.68)
  other vias: 110.49,44.96
N$98  (via drill 0.6 pad 1.68)
  other vias: 110.49,42.42
N$99  (via drill 0.6 pad 1.68)
  other vias: 110.49,39.88
N$100  (via drill 0.6 pad 1.68)
  other vias: 110.49,37.34
N$101
  Top 1.27: V1.4 67.31,30.99 59.69,23.37 JP2.2
N$102
  Top 1.27: JP2.3 57.15,24.64 66.04,33.53 72.39,33.53 74.93,36.07 V1.2

### Text on the board
Top: TOP | 344 PLATOON | 2013 | 1 | 1 | 1 | 1 | 1 | +
Bottom: BOTTOM | +